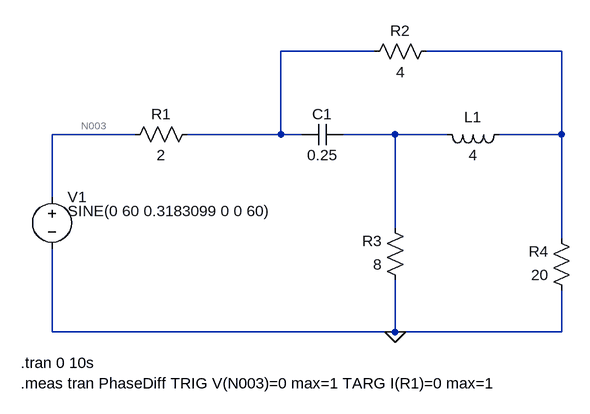
[diagram p0: schematic ch-13-prob-53.asc]
ch-13-prob-53.asc, the LTspice schematic file:
Version 4
SHEET 1 884 680
WIRE 576 64 432 64
WIRE 864 64 656 64
WIRE 208 192 80 192
WIRE 432 192 432 64
WIRE 432 192 288 192
WIRE 464 192 432 192
WIRE 608 192 528 192
WIRE 688 192 608 192
WIRE 864 192 864 64
WIRE 864 192 768 192
WIRE 80 288 80 192
WIRE 608 336 608 192
WIRE 864 352 864 192
WIRE 80 496 80 368
WIRE 608 496 608 416
WIRE 608 496 80 496
WIRE 864 496 864 432
WIRE 864 496 608 496
FLAG 608 496 0
SYMBOL voltage 80 272 R0
WINDOW 3 24 38 Left 2
SYMATTR InstName V1
SYMATTR Value SINE(0 60 0.3183099 0 0 60)
SYMBOL Res 304 176 R90
WINDOW 0 0 56 VBottom 2
WINDOW 3 32 56 VTop 2
SYMATTR InstName R1
SYMATTR Value 2
SYMBOL Res 672 48 R90
WINDOW 0 0 56 VBottom 2
WINDOW 3 32 56 VTop 2
SYMATTR InstName R2
SYMATTR Value 4
SYMBOL Res 624 432 R180
WINDOW 0 36 76 Left 2
WINDOW 3 36 40 Left 2
SYMATTR InstName R3
SYMATTR Value 8
SYMBOL Res 880 448 R180
WINDOW 0 36 76 Left 2
WINDOW 3 36 40 Left 2
SYMATTR InstName R4
SYMATTR Value 20
SYMBOL Cap 528 176 R90
WINDOW 0 0 32 VBottom 2
WINDOW 3 32 32 VTop 2
SYMATTR InstName C1
SYMATTR Value 0.25
SYMBOL ind 784 176 R90
WINDOW 0 5 56 VBottom 2
WINDOW 3 32 56 VTop 2
SYMATTR InstName L1
SYMATTR Value 4
TEXT 32 544 Left 2 !.tran 0 10s\n.meas tran PhaseDiff TRIG V(N003)=0 max=1 TARG I(R1)=0 max=1

The netlist it stands for:
* ch-13-prob-53.asc
V1 N003 0 SINE(0 60 0.3183099 0 0 60)
R1 N001 N003 2
R2 N002 N001 4
R3 0 N004 8
R4 0 N002 20
C1 N004 N001 0.25
L1 N002 N004 4
.tran 0 10s
.meas tran PhaseDiff TRIG V(N003)=0 max=1 TARG I(R1)=0 max=1
.backanno
.end